# EAGLE design sensing (EAGLE 9.5.1)
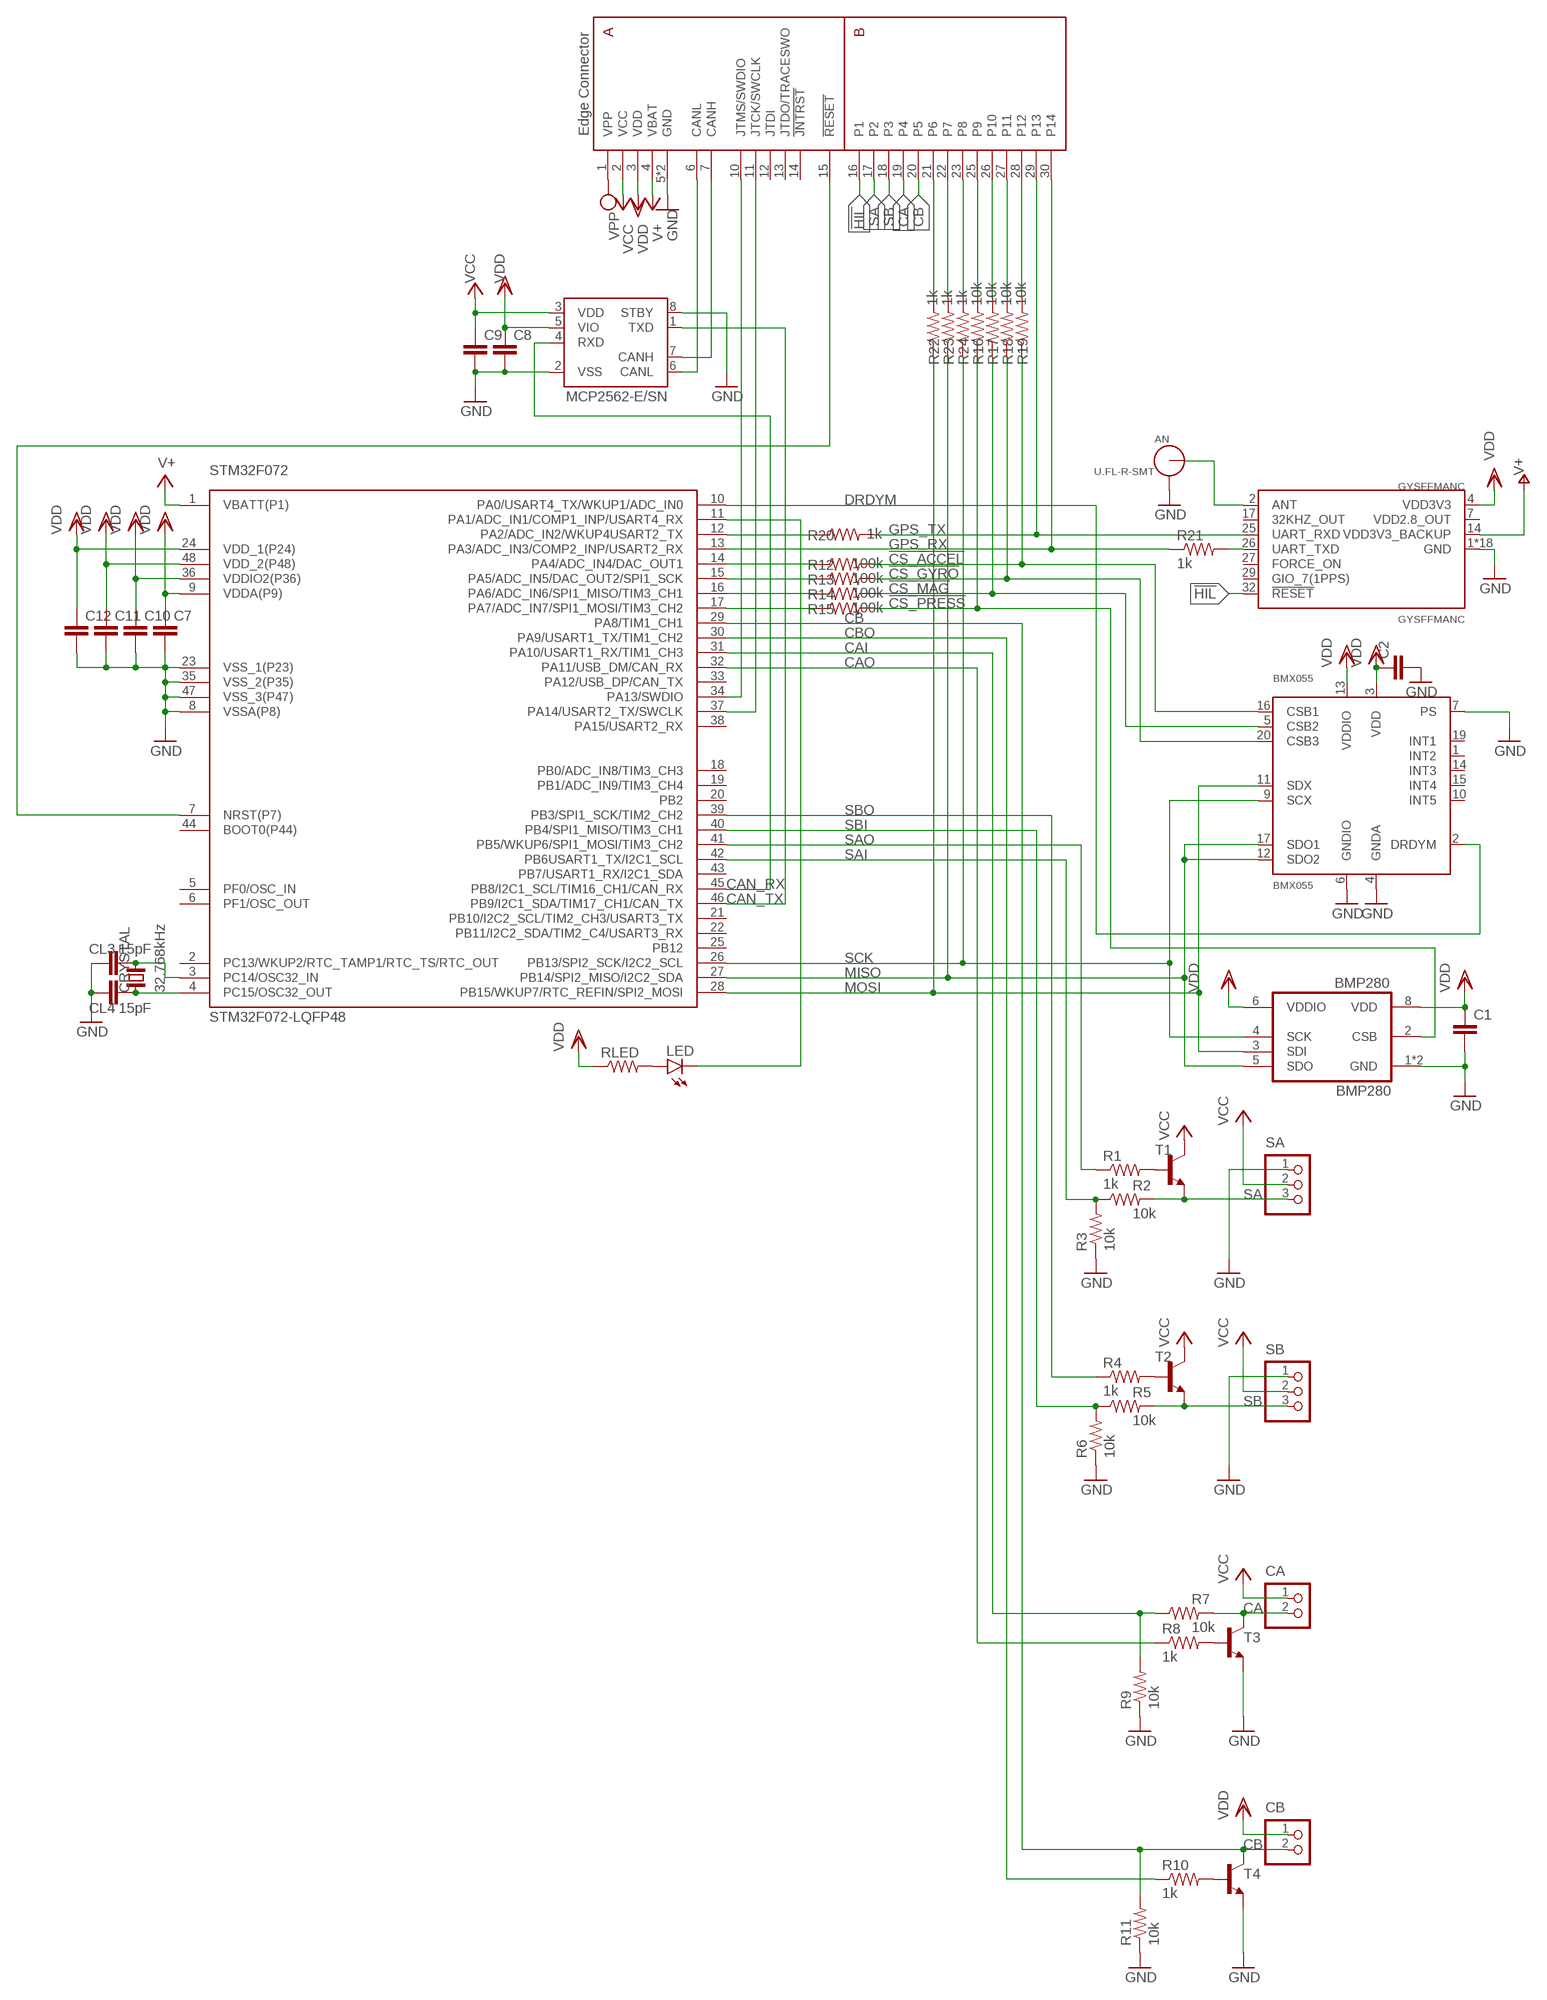
[diagram p0: schematic, sheet 1]

## Parts
AN  U.FL-R-SMT  [U.FL_SMT]
BMP280  BMP280  [BMP280]
BMX055  BMX055  [BMX055]
C1  C-EUC0603K  [C0603K]
C2  C-EUC0603K  [C0603K]
C7  C-EUC0603K  [C0603K]
C8  C-EUC0603K  [C0603K]
C9  C-EUC0603K  [C0603K]
C10  C-EUC0603K  [C0603K]
C11  C-EUC0603K  [C0603K]
C12  C-EUC0603K  [C0603K]
CA  S2B-PH-K-S  [S2B-PH-K-S]
CB  S2B-PH-K-S  [S2B-PH-K-S]
CL3  15pF  C-EUC0603K  [C0603K]
CL4  15pF  C-EUC0603K  [C0603K]
CRYSTAL  32.768kHz  CRYTALFC-255  [FC-255]
GYSFFMANC  GYSFFMANC  [GYSFFMANC]
LED  LEDCHIP-LED0603  [CHIP-LED0603]
MCP2562  MCP2562-E/SN  [SOIC127P600X175-8N]
R1  1k  R-US_R0603  [R0603]
R2  10k  R-US_R0603  [R0603]
R3  10k  R-US_R0603  [R0603]
R4  1k  R-US_R0603  [R0603]
R5  10k  R-US_R0603  [R0603]
R6  10k  R-US_R0603  [R0603]
R7  10k  R-US_R0603  [R0603]
R8  1k  R-US_R0603  [R0603]
R9  10k  R-US_R0603  [R0603]
R10  1k  R-US_R0603  [R0603]
R11  10k  R-US_R0603  [R0603]
R12  100k  R-US_R0603  [R0603]
R13  100k  R-US_R0603  [R0603]
R14  100k  R-US_R0603  [R0603]
R15  100k  R-US_R0603  [R0603]
R16  10k  R-US_R0603  [R0603]
R17  10k  R-US_R0603  [R0603]
R18  10k  R-US_R0603  [R0603]
R19  10k  R-US_R0603  [R0603]
R20  1k  R-US_R0603  [R0603]
R21  1k  R-US_R0603  [R0603]
R22  1k  R-US_R0603  [R0603]
R23  1k  R-US_R0603  [R0603]
R24  1k  R-US_R0603  [R0603]
RLED  R-US_R0603  [R0603]
SA  S3B-PH-K-S  [S3B-PH-K-S]
SB  S3B-PH-K-S  [S3B-PH-K-S]
STM32F072  STM32F072-LQFP48  [LQFP48]
T1  BC817-NPN-SOT23-BEC  [SOT23-BEC]
T2  BC817-NPN-SOT23-BEC  [SOT23-BEC]
T3  BC817-NPN-SOT23-BEC  [SOT23-BEC]
T4  BC817-NPN-SOT23-BEC  [SOT23-BEC]
U$2  EDGE30  [EDGE30]

## Nets
!CS_ACCEL!: BMX055.16(CSB1) R12.2 R19.1
!CS_GYRO!: BMX055.20(CSB3) R13.2 R18.1
!CS_MAG!: BMX055.5(CSB2) R14.2 R17.1
!CS_PRESS!: BMP280.2(CSB) R15.2 R16.1
!HIL!: GYSFFMANC.32(!RESET!) U$2.16(P1)
CA: CA.2 R7.2 T3.C U$2.19(P4)
CAI: R7.1 R9.2 STM32F072.31(PA10/USART1_RX/TIM1_CH3)
CAN_RX: MCP2562.4(RXD) STM32F072.45(PB8/I2C1_SCL/TIM16_CH1/CAN_RX)
CAN_TX: MCP2562.1(TXD) STM32F072.46(PB9/I2C1_SDA/TIM17_CH1/CAN_TX)
CANH1: MCP2562.7(CANH) U$2.7(CANH)
CANL1: MCP2562.6(CANL) U$2.6(CANL)
CAO: R8.1 STM32F072.32(PA11/USB_DM/CAN_RX)
CB: CB.2 R11.2 STM32F072.29(PA8/TIM1_CH1) T4.C U$2.20(P5)
CBO: R10.1 STM32F072.30(PA9/USART1_TX/TIM1_CH2)
DRDYM: BMX055.2(DRDYM) STM32F072.10(PA0/USART4_TX/WKUP1/ADC_IN0)
GND: AN.GND1 AN.GND2 BMP280.1(GND) BMP280.7(GND) BMX055.4(GNDA) BMX055.6(GNDIO) BMX055.7(PS) C1.2 C2.2 C7.2 C8.2 C9.2 C10.2 C11.2 C12.2 CL3.1 CL4.1 GYSFFMANC.1(GND) GYSFFMANC.3(GND) GYSFFMANC.8(GND) GYSFFMANC.10(GND) GYSFFMANC.12(GND) GYSFFMANC.22(GND) GYSFFMANC.33(GND) GYSFFMANC.36(GND) GYSFFMANC.37(GND) GYSFFMANC.38(GND) GYSFFMANC.39(GND) GYSFFMANC.40(GND) GYSFFMANC.41(GND) GYSFFMANC.42(GND) GYSFFMANC.43(GND) GYSFFMANC.44(GND) GYSFFMANC.45(GND) GYSFFMANC.46(GND) MCP2562.2(VSS) MCP2562.8(STBY) R3.1 R6.1 R9.1 R11.1 SA.1 SB.1 STM32F072.8(VSSA(P8)) STM32F072.23(VSS_1(P23)) STM32F072.35(VSS_2(P35)) STM32F072.47(VSS_3(P47)) T3.E T4.E U$2.5(GND) U$2.8(GND)
GPS_RX: R21.1 STM32F072.13(PA3/ADC_IN3/COMP2_INP/USART2_RX) U$2.30(P14)
GPS_TX: GYSFFMANC.25(UART_RXD) R20.2 U$2.29(P13)
MISO: BMP280.5(SDO) BMX055.12(SDO2) BMX055.17(SDO1) R23.1 STM32F072.27(PB14/SPI2_MISO/I2C2_SDA)
MOSI: BMP280.3(SDI) BMX055.11(SDX) R22.1 STM32F072.28(PB15/WKUP7/RTC_REFIN/SPI2_MOSI)
N$1: AN.SIG(ANT) GYSFFMANC.2(ANT)
N$2: R12.1 STM32F072.14(PA4/ADC_IN4/DAC_OUT1)
N$5: R1.2 T1.B
N$6: R4.2 T2.B
N$7: R13.1 STM32F072.15(PA5/ADC_IN5/DAC_OUT2/SPI1_SCK)
N$8: R14.1 STM32F072.16(PA6/ADC_IN6/SPI1_MISO/TIM3_CH1)
N$10: R15.1 STM32F072.17(PA7/ADC_IN7/SPI1_MOSI/TIM3_CH2)
N$11: R20.1 STM32F072.12(PA2/ADC_IN2/WKUP4USART2_TX)
N$12: GYSFFMANC.26(UART_TXD) R21.2
N$13: R8.2 T3.B
N$14: R10.2 T4.B
N$15: R24.2 U$2.23(P8)
N$16: R23.2 U$2.22(P7)
N$17: R22.2 U$2.21(P6)
N$34: R19.2 U$2.28(P12)
N$35: R18.2 U$2.27(P11)
N$36: R17.2 U$2.26(P10)
N$43: R16.2 U$2.25(P9)
N$51: LED.C STM32F072.11(PA1/ADC_IN1/COMP1_INP/USART4_RX)
N$70: CL4.2 CRYSTAL.1 STM32F072.4(PC15/OSC32_OUT)
N$71: CL3.2 CRYSTAL.2 STM32F072.3(PC14/OSC32_IN)
N$74: LED.A RLED.2
NRST1: STM32F072.7(NRST(P7)) U$2.15(!RESET!)
SA: R2.2 SA.3 T1.E U$2.17(P2)
SAI: R2.1 R3.2 STM32F072.42(PB6USART1_TX/I2C1_SCL)
SAO: R1.1 STM32F072.41(PB5/WKUP6/SPI1_MOSI/TIM3_CH2)
SB: R5.2 SB.3 T2.E U$2.18(P3)
SBI: R5.1 R6.2 STM32F072.40(PB4/SPI1_MISO/TIM3_CH1)
SBO: R4.1 STM32F072.39(PB3/SPI1_SCK/TIM2_CH2)
SCK: BMP280.4(SCK) BMX055.9(SCX) R24.1 STM32F072.26(PB13/SPI2_SCK/I2C2_SCL)
SWCLK1: STM32F072.37(PA14/USART2_TX/SWCLK) U$2.11(JTCK/SWCLK)
SWDIO1: STM32F072.34(PA13/SWDIO) U$2.10(JTMS/SWDIO)
VBAT: GYSFFMANC.14(VDD3V3_BACKUP) STM32F072.1(VBATT(P1)) U$2.4(VBAT) ; supply symbol labelled V+
VCC: C9.1 CA.1 MCP2562.3(VDD) SA.2 SB.2 T1.C T2.C U$2.2(VCC)
VDD: BMP280.6(VDDIO) BMP280.8(VDD) BMX055.3(VDD) BMX055.13(VDDIO) C1.1 C2.1 C7.1 C8.1 C10.1 C11.1 C12.1 CB.1 GYSFFMANC.4(VDD3V3) MCP2562.5(VIO) RLED.1 STM32F072.9(VDDA(P9)) STM32F072.24(VDD_1(P24)) STM32F072.36(VDDIO2(P36)) STM32F072.48(VDD_2(P48)) U$2.3(VDD)
VPP: U$2.1(VPP)
Unconnected: BMX055.1(INT2) BMX055.10(INT5) BMX055.14(INT3) BMX055.15(INT4) BMX055.19(INT1) GYSFFMANC.17(32KHZ_OUT) GYSFFMANC.27(FORCE_ON) GYSFFMANC.29(GIO_7(1PPS)) STM32F072.2(PC13/WKUP2/RTC_TAMP1/RTC_TS/RTC_OUT) STM32F072.5(PF0/OSC_IN) STM32F072.6(PF1/OSC_OUT) STM32F072.18(PB0/ADC_IN8/TIM3_CH3) STM32F072.19(PB1/ADC_IN9/TIM3_CH4) STM32F072.20(PB2) STM32F072.21(PB10/I2C2_SCL/TIM2_CH3/USART3_TX) STM32F072.22(PB11/I2C2_SDA/TIM2_C4/USART3_RX) STM32F072.25(PB12) STM32F072.33(PA12/USB_DP/CAN_TX) STM32F072.38(PA15/USART2_RX) STM32F072.43(PB7/USART1_RX/I2C1_SDA) STM32F072.44(BOOT0(P44)) U$2.12(JTDI) U$2.13(JTDO/TRACESWO) U$2.14(!JNTRST!)

## Power pins joined to a net without a drawn wire
VDD2.8_OUT: GYSFFMANC.7(VDD2.8_OUT)

## Library data of the parts
AN = connector:U.FL-R-SMT: U.FL-R-SMT Antenna Connector; DIGIKEY: H122041-ND; MANUFACTURER: Hirose; MPN: U.FL-R-SMT-1(01)
BMP280 = bosch-bmp280:BMP280: The BMP280 is an absolute barometric pressure sensor especially designed for mobile applications. The sensor module is housed in an extremely compact 8-pin metal-lid LGA package with a footprint of only 2.0 × 2.5 mm2 and 0.95 mm package height. Its small dimensions and its low power consumption of 2.7 μA @1Hz allow the implementation in battery driven devices such as mobile phones, GPS modules or watches. The library has been designed by Richard Magdycz <https://www.facebook.com/groups/eaglecadsoftUK>
BMX055 = BMX055:BMX055: BMX055 Small, versatile 9 - axis sensor module; DIGI-KEY_PART_NUMBER: 828-1060-1-ND; DIGI-KEY_PURCHASE_URL: https://www.digikey.jp/product-detail/en/bosch-sensortec/BMX055/828-1060-1-ND/6136311?utm_source=snapeda&utm_medium=aggregator&utm_campaign=symbol; MF: Bosch Sensortec; MP: BMX055; PACKAGE: LGA-20 Bosch
C1 C2 C7-C12 CL3 CL4 = rcl:C-EU: CAPACITOR, European symbol; SPICEPREFIX: C
CA CB = jst-ph:S2B-PH-*: Wire-to-Board 2.0mm pitch side mount connector Source: http://www.jst-mfg.com/product/pdf/jpn/PH.pdf http://www.jst-mfg.com/product/detail.php?series=199
CRYSTAL = crystal':CRYTAL: CRYSTAL
GYSFFMANC = gps:GYSFFMANC
LED = led:LED: LED OSRAM: - CHIPLED LG R971, LG N971, LY N971, LG Q971, LY Q971, LO R971, LY R971 LH N974, LH R974 LS Q976, LO Q976, LY Q976 LO Q996 - Hyper CHIPLED LW Q18S LB Q993, LB Q99A, LB R99A - SideLED LS A670, LO A670, LY A670, LG A670, LP A670 LB A673, LV A673, LT A673, LW A673 LH A674 LY A675 LS A676, LA A676, LO A676, LY A676, LW A676 LS A679, LY A679, LG A679 - Hyper Micro SIDELED® LS Y876, LA Y876, LO Y876, LY Y876 LT Y87S - SmartLED LW L88C, LW L88S LB L89C, LB L89S, LG L890 LS L89K, LO L89K, LY L89K LS L896, LA L896, LO L896, LY L896 - TOPLED LS T670, LO T670, LY T670, LG T670, LP T670 LSG T670, LSP T670, LSY T670, LOP T670, LYG T670 LG T671, LOG T671, LSG T671 LB T673, LV T673, LT T673, LW T673 LH T674 LS T676, LA T676, LO T676, LY T676, LB T676, LH T676, LSB T676, LW T676 LB T67C, LV T67C, LT T67C, LS T67K, LO T67K, LY T67K, LW E67C LS E67B, LA E67B, LO E67B, LY E67B, LB E67C, LV E67C, LT E67C LW T67C LS T679, LY T679, LG T679 LS T770, LO T770, LY T770, LG T770, LP T770 LB T773, LV T773, LT T773, LW T773 LH T774 LS E675, LA E675, LY E675, LS T675 LS T776, LA T776, LO T776, LY T776, LB T776 LHGB T686 LT T68C, LB T68C - Hyper Mini TOPLED® LB M676 - Mini TOPLED Santana® LG M470 LS M47K, LO M47K, LY M47K Source: http://www.osram.convergy.de LUXEON: - LUMILED® LXK2-PW12-R00, LXK2-PW12-S00, LXK2-PW14-U00, LXK2-PW14-V00 LXK2-PM12-R00, LXK2-PM12-S00, LXK2-PM14-U00 LXK2-PE12-Q00, LXK2-PE12-R00, LXK2-PE12-S00, LXK2-PE14-T00, LXK2-PE14-U00 LXK2-PB12-K00, LXK2-PB12-L00, LXK2-PB12-M00, LXK2-PB14-N00, LXK2-PB14-P00, LXK2-PB14-Q00 LXK2-PR12-L00, LXK2-PR12-M00, LXK2-PR14-Q00, LXK2-PR14-R00 LXK2-PD12-Q00, LXK2-PD12-R00, LXK2-PD12-S00 LXK2-PH12-R00, LXK2-PH12-S00 LXK2-PL12-P00, LXK2-PL12-Q00, LXK2-PL12-R00 Source: www.luxeon.com KINGBRIGHT: KA-3528ASYC Source: www.kingbright.com
MCP2562 = mcp2562-E_SN:MCP2562-E/SN: MCP2562 Series 5 V Surface Mount High-Speed CAN Transceiver - SOIC-8; AVAILABILITY: Unavailable; DESCRIPTION: Microchip MCP2562-E/SN, CAN Transceiver 1MBps 1-channel IEC 61000-4-2, 8-Pin SOIC; MF: Microchip; MP: MCP2562-E/SN; PACKAGE: SO-8 Microchip; PRICE: None
R1-R24 = resistor:R-US_: RESISTOR, American symbol
RLED = rcl:R-US_: RESISTOR, American symbol; SPICEPREFIX: R
SA SB = jst-ph:S3B-PH-*: Wire-to-Board 2.0mm pitch side mount connector Source: http://www.jst-mfg.com/product/pdf/jpn/PH.pdf http://www.jst-mfg.com/product/detail.php?series=199
STM32F072 = stm32f0:STM32F072
T1-T4 = transistor-neu-to92:*-NPN-: NPN Transistror
U$2 = bus:EDGE30

## Board
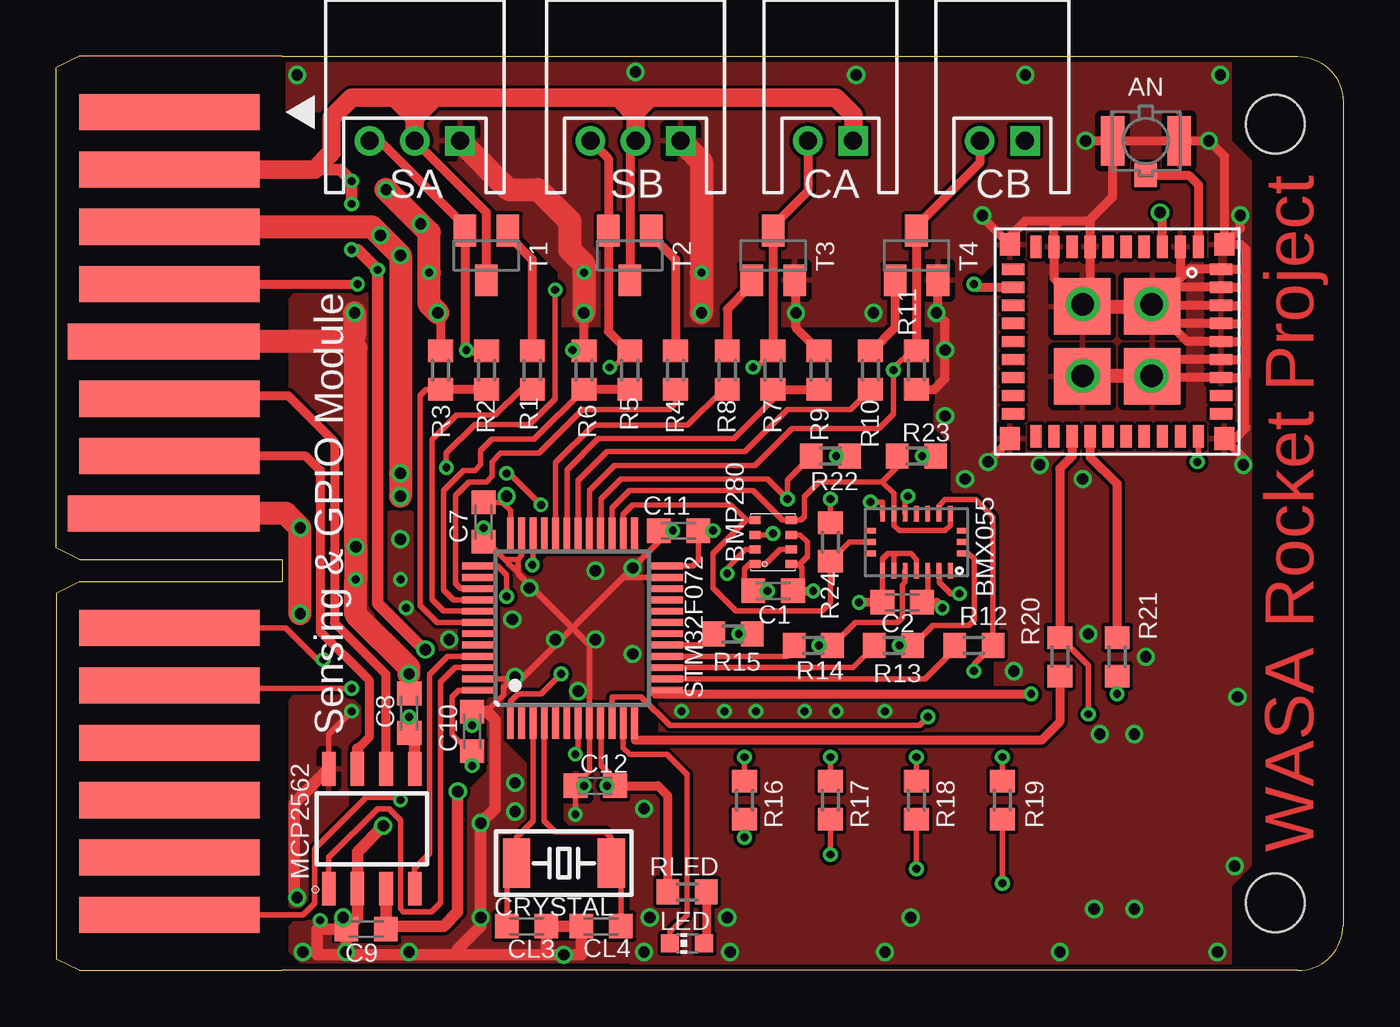
[diagram p1: board, top side]
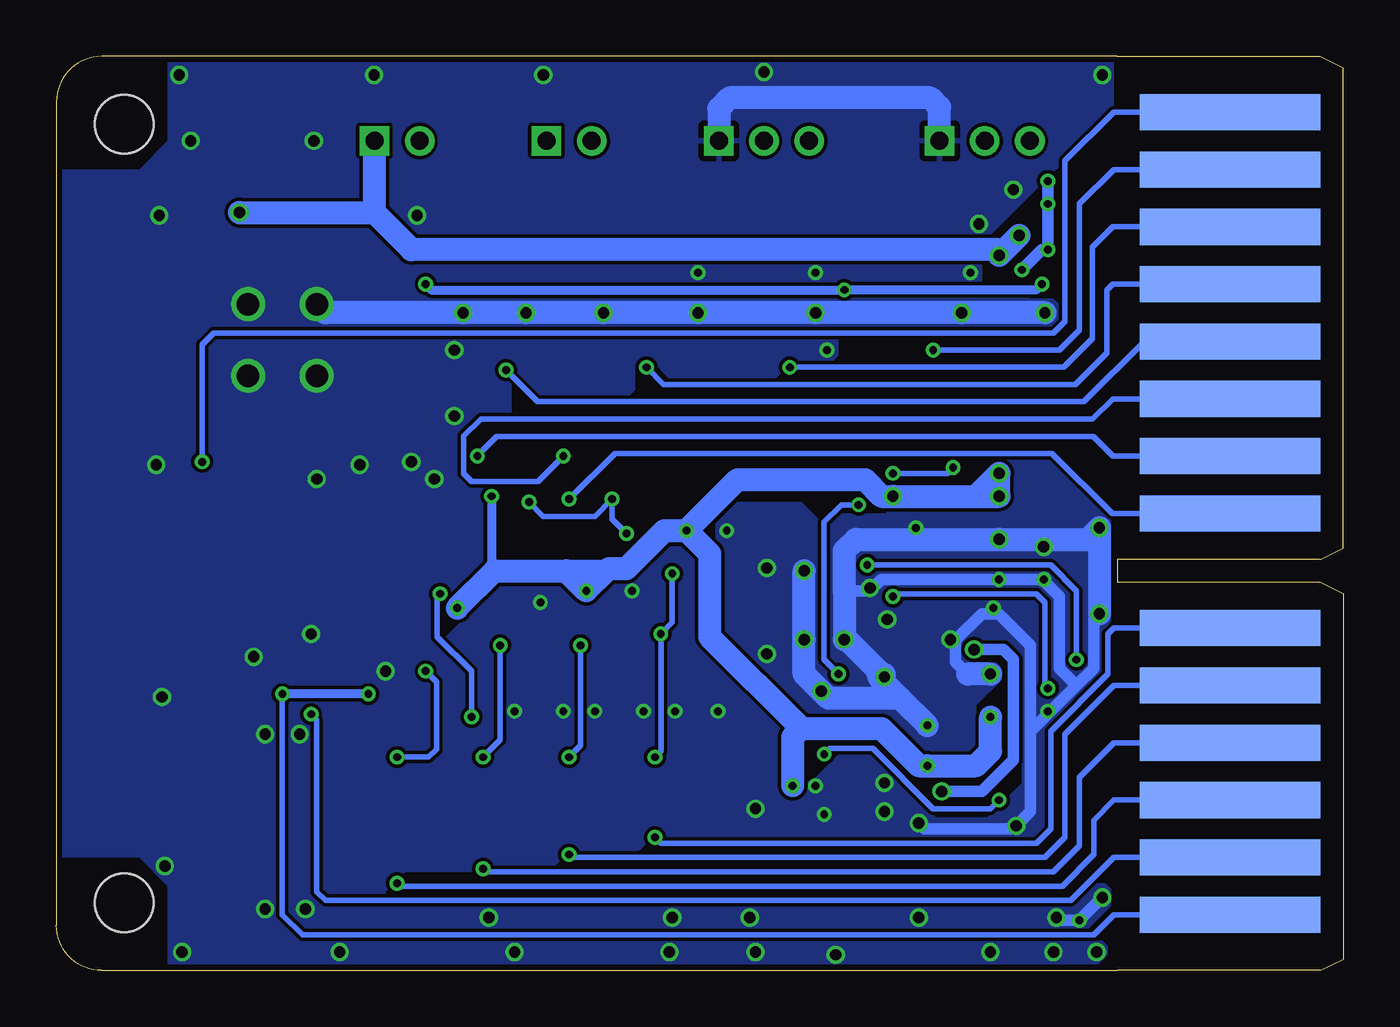
[diagram p2: board, bottom side, seen from below]

Size 57 x 40.5 mm. Coordinates in mm from the lower left corner, seen from the top.
Outline: 10,40.5 55,40.5 arc-90 57,38.5 57,2 arc-90 55,0 10,0
Copper layers (1*16): Top 0.035mm / dielectric 1.5mm / Bottom 0.035mm
Design rules "SeeedStudio_2layer_DRU_no_angle_20140221": minimum track width 6mil, minimum drill 12mil, track to track 6mil, track to pad 6mil, pad to pad 6mil, via to via 6mil, smd to smd 0mil, copper to edge 10mil, drill to drill 10mil, minimum pad ring 10mil, minimum via ring 6mil, stop-mask expansion 2mil, vias tented up to drill 100mil, thermal gap 10mil
Holes 2.6 mm at 54,3 54,37.5

### Footprints (pad centres in the part's own frame; a part is rotated, then mirrored left to right if it is on the bottom)
U.FL_SMT = smd 1.05 x 2.2: GND1 -1.475,0; GND2 1.475,0 | smd 1 x 1.05: SIG 0,-1.525
BMP280 = smd 0.35 x 0.5: 1 0.975,-0.8; 2 0.325,-0.8; 3 -0.325,-0.8; 4 -0.975,-0.8; 5 -0.975,0.8; 6 -0.325,0.8; 7 0.325,0.8; 8 0.975,0.8
BMX055 = smd 0.675 x 0.25: 1 1.262,1.5; 2 1.262,1; 3 1.262,0.5; 4 1.262,0; 5 1.262,-0.5; 6 1.262,-1; 7 1.262,-1.5; 11 -1.262,-1.5; 12 -1.262,-1; 13 -1.262,-0.5; 14 -1.262,0; 15 -1.262,0.5; 16 -1.262,1; 17 -1.262,1.5 | smd 0.25 x 0.55: 8 0.5,-2.05; 9 0,-2.05; 10 -0.5,-2.05; 18 -0.5,2.05; 19 0,2.05; 20 0.5,2.05
C0603K = smd 1.05 x 1.08: 1 -0.875,0; 2 0.875,0
S2B-PH-K-S = drill 0.8 square: 1 1,0 | drill 0.8: 2 -1,0
FC-255 = smd 1.2 x 2.2: 1 -2.1,0; 2 2.1,0
GYSFFMANC = smd 1 x 0.9: 1 -4.3,4.75; 12 -4.3,-4.75; 22 4.3,-4.75; 33 4.3,4.75 | smd 1 x 0.5: 2 -4.2,3.6; 3 -4.2,2.8; 4 -4.2,2; 5 -4.2,1.2; 6 -4.2,0.4; 7 -4.2,-0.4; 8 -4.2,-1.2; 9 -4.2,-2; 10 -4.2,-2.8; 11 -4.2,-3.6; 23 4.2,-3.6; 24 4.2,-2.8; 25 4.2,-2; 26 4.2,-1.2; 27 4.2,-0.4; 28 4.2,0.4; 29 4.2,1.2; 30 4.2,2; 31 4.2,2.8; 32 4.2,3.6 | smd 0.5 x 1: 13 -3.2,-4.6; 14 -2.4,-4.6; 15 -1.6,-4.6; 16 -0.8,-4.6; 17 0,-4.6; 18 0.8,-4.6; 19 1.6,-4.6; 20 2.4,-4.6; 21 3.2,-4.6; 34 3.2,4.6; 35 2.4,4.6; 36 1.6,4.6; 37 0.8,4.6; 38 0,4.6; 39 -0.8,4.6; 40 -1.6,4.6; 41 -2.4,4.6; 42 -3.2,4.6 | smd 2.5 x 2.5: 43 -1.55,1.55; 44 -1.55,-1.55; 45 1.55,-1.55; 46 1.55,1.55
CHIP-LED0603 = smd 0.8 x 0.8: A 0,-0.75; C 0,0.75
SOIC127P600X175-8N = smd 1.5 x 0.6: 1 -2.65,1.905; 2 -2.65,0.635; 3 -2.65,-0.635; 4 -2.65,-1.905; 5 2.65,-1.905; 6 2.65,-0.635; 7 2.65,0.635; 8 2.65,1.905
R0603 = smd 1 x 1.1: 1 -0.85,0; 2 0.85,0
S3B-PH-K-S = drill 0.8 square: 1 2,0 | drill 0.8: 2 0,0; 3 -2,0
LQFP48 = smd 1.5 x 0.3: 1 -4.15,2.75; 2 -4.15,2.25; 3 -4.15,1.75; 4 -4.15,1.25; 5 -4.15,0.75; 6 -4.15,0.25; 7 -4.15,-0.25; 8 -4.15,-0.75; 9 -4.15,-1.25; 10 -4.15,-1.75; 11 -4.15,-2.25; 12 -4.15,-2.75; 25 4.15,-2.75; 26 4.15,-2.25; 27 4.15,-1.75; 28 4.15,-1.25; 29 4.15,-0.75; 30 4.15,-0.25; 31 4.15,0.25; 32 4.15,0.75; 33 4.15,1.25; 34 4.15,1.75; 35 4.15,2.25; 36 4.15,2.75 | smd 0.3 x 1.5: 13 -2.75,-4.15; 14 -2.25,-4.15; 15 -1.75,-4.15; 16 -1.25,-4.15; 17 -0.75,-4.15; 18 -0.25,-4.15; 19 0.25,-4.15; 20 0.75,-4.15; 21 1.25,-4.15; 22 1.75,-4.15; 23 2.25,-4.15; 24 2.75,-4.15; 37 2.75,4.15; 38 2.25,4.15; 39 1.75,4.15; 40 1.25,4.15; 41 0.75,4.15; 42 0.25,4.15; 43 -0.25,4.15; 44 -0.75,4.15; 45 -1.25,4.15; 46 -1.75,4.15; 47 -2.25,4.15; 48 -2.75,4.15
SOT23-BEC = smd 1 x 1.4: B -0.95,-1.1; C 0,1.1; E 0.95,-1.1
EDGE30 = smd 1.6 x 8: 1 -17.78,-5; 2 -15.24,-5; 3 -12.7,-5; 4 -10.16,-5; 6 -5.08,-5; 7 -2.54,-5; 10 5.08,-5; 11 7.62,-5; 12 10.16,-5; 13 12.7,-5; 14 15.24,-5; 15 17.78,-5 | smd 1.6 x 8.5: 5 -7.62,-5.25; 8 0,-5.25 | smd 1.6 x 8 bottom: 16 -17.78,-5; 17 -15.24,-5; 18 -12.7,-5; 19 -10.16,-5; 20 -7.62,-5; 21 -5.08,-5; 22 -2.54,-5; 23 0,-5; 25 5.08,-5; 26 7.62,-5; 27 10.16,-5; 28 12.7,-5; 29 15.24,-5; 30 17.78,-5

### Placement (x,y rotation side)
AN  48.26,36.76 0 top
BMP280  31.75,18.98 270 top
BMX055  38.1,18.98 270 top
C1  31.75,16.82 180 top
C2  37.47,16.31 180 top
C7  18.92,19.87 270 top
C8  15.63,11.41 90 top
C9  13.72,1.84 180 top
C10  18.41,10.6 90 top
C11  27.56,19.49 180 top
C12  23.88,8.19 180 top
CA  34.29,36.76 0 top
CB  41.91,36.76 0 top
CL3  20.83,1.96 180 top
CL4  24.13,1.96 0 top
CRYSTAL  22.48,4.76 180 top
GYSFFMANC  46.99,27.87 270 top
LED  27.94,1.2 90 top
MCP2562  13.97,6.28 90 top
R1  21.08,26.6 90 top
R2  19.05,26.6 90 top
R3  17.02,26.6 270 top
R4  27.43,26.6 90 top
R5  25.4,26.6 90 top
R6  23.37,26.6 270 top
R7  31.75,26.6 90 top
R8  29.72,26.6 90 top
R9  33.78,26.6 270 top
R10  36.07,26.6 90 top
R11  38.1,26.6 90 top
R12  40.64,14.41 0 top
R13  37.08,14.41 0 top
R14  33.53,14.41 0 top
R15  29.97,14.92 0 top
R16  30.48,7.55 270 top
R17  34.29,7.55 270 top
R18  38.1,7.55 270 top
R19  41.91,7.55 270 top
R20  44.45,13.9 90 top
R21  46.99,13.9 90 top
R22  34.29,22.79 0 top
R23  38.1,22.79 0 top
R24  34.29,18.98 90 top
RLED  27.94,3.49 0 top
SA  15.88,36.76 0 top
SB  25.65,36.76 0 top
STM32F072  22.86,15.17 90 top
T1  19.05,31.68 180 top
T2  25.4,31.68 180 top
T3  31.75,31.68 0 top
T4  38.1,31.68 0 top
U$2  10,20.25 270 top

### Tracks (layer width: path | path; a pad name or v marks a point on that pad's centre or on a via)
!CS_ACCEL!  (via drill 0.35)
  Top 0.254: BMX055.16 39.1,20.59 39.37,20.86 40.73,20.86 41.49,20.1 R12.2 40.64,13.56 v40.64,13.27 | R19.1 v41.91,9.46
  Bottom 0.254: v40.64,13.27 40.16,12.79 40.16,9.81 40.51,9.46 v41.91,9.46
!CS_GYRO!  (via drill 0.35)
  Top 0.254: BMX055.20 40.4,18.48 40.66,18.23 40.66,15.53 40.42,15.3 38.82,15.3 R13.2 v37.34,14.41 | R18.1 v38.1,9.46
  Bottom 0.254: v37.34,14.41 37.34,10.22 v38.1,9.46
!CS_MAG!  (via drill 0.35)
  Top 0.254: BMX055.5 37.6,17.21 37.47,17.08 37.47,15.65 37.25,15.42 35.39,15.42 R14.2 v33.78,14.41 | R17.1 v34.29,9.46
  Bottom 0.254: v33.78,14.41 33.78,9.96 v34.29,9.46
!CS_PRESS!  (via drill 0.35)
  Top 0.254: BMP280.2 30.54,18.66 29.72,17.84 v29.72,17.58 | R15.2 v30.23,14.92 | R16.1 v30.48,9.46
  Bottom 0.254: v29.72,17.58 29.72,15.42 v30.23,14.92 30.23,9.71 v30.48,9.46
!HIL!  (via drill 0.35)
  Top 0.254: GYSFFMANC.32 50.59,22.58 v50.55,22.54
  Bottom 0.254: U$2.16 10.16,38.03 12.32,35.87 12.32,28.76 12.83,28.25 50.04,28.25 50.55,27.74 v50.55,22.54
CA  (via drill 0.35)
  Top 0.254: R7.2 31.03,26.73 v30.86,26.73
  Top 0.406: R7.2 T3.C 31.75,32.98 33.29,34.52 CA.2
  Bottom 0.254: U$2.19 10.21,30.41 10.46,30.16 10.46,27.36 11.86,25.96 30.1,25.96 v30.86,26.73
CAI
  Top 0.254: R7.1 31.75,25.29 30.02,23.56 24,23.56 22.61,22.17 STM32F072.31
  Top 0.406: R7.1 R9.2
CAN_RX
  Top 0.254: STM32F072.45 17.33,13.92 16.54,13.13 16.54,5.18 15.88,4.52 MCP2562.4
CAN_TX
  Top 0.254: STM32F072.46 17.66,13.42 17.02,12.78 17.02,3 16.61,2.6 15.37,2.6 15.24,2.72 15.24,6.66 14.73,7.17 14.22,7.17 12.06,5.01 MCP2562.1
CANH1
  Top 0.406: 13.34,9.82 13.84,10.33 13.84,12.87 11.68,15.03 11.68,22.16 11.05,22.79 U$2.7
  Top 0.508: MCP2562.7 13.34,9.82
CANL1
  Top 0.406: MCP2562.6 14.61,13.12 12.32,15.41 12.32,23.43 10.29,25.46 5.13,25.46 U$2.6
CAO
  Top 0.254: R8.1 29.54,25.75 27.97,24.18 23.79,24.18 22.11,22.5 STM32F072.32
CB  (via drill 0.35)
  Top 0.254: R11.2 37.85,27.45 37.08,26.69 v37.08,26.6 37.08,24.66 36.45,24.02 32.59,24.02 30.95,22.38 24.73,22.38 23.61,21.26 STM32F072.29
  Top 0.406: R11.2 T4.C 38.1,32.98 40.91,35.79 CB.2
  Bottom 0.254: U$2.20 8.81,27.87 11.48,25.2 35.56,25.2 35.69,25.2 v37.08,26.6
CBO
  Top 0.254: R10.1 35.18,24.86 32.38,24.86 30.51,22.99 24.38,22.99 23.11,21.71 STM32F072.30
DRDYM  (via drill 0.35)
  Top 0.254: STM32F072.10 24.61,12.09 24.64,12.12 25.91,12.12 27.18,10.85 38.23,10.85 v38.61,11.23 | BMX055.2 39.12,17.7 39.12,17.2 39.62,16.69 v40.01,16.69
  Bottom 0.254: v40.01,16.69 40.13,16.57 40.13,14.79 38.61,13.27 v38.61,11.23
GND  (via drill 0.35, 0.5, 1)
  Top 0.254: STM32F072.35 20.61,18.38 20.45,18.22 | 20.45,17.63 20.45,18.22 | STM32F072.47 20.19,12.92 | 20.19,12.92 20.61,12.92 22.86,15.17 | 22.86,15.17 20.45,17.58 20.45,17.63 | 22.86,15.17 23.61,14.42 STM32F072.8 23.61,8.82 23,8.21 C12.2 23,6.93 v22.99,6.91 | STM32F072.23 25.11,17.42 | 22.86,15.17 25.11,17.42 | 19.16,11.47 19.06,11.47 19.81,12.22 19.81,12.54 20.19,12.92 | C7.2 19.18,18.74 19.34,18.74 19.86,18.22 | 20.45,18.22 19.86,18.22 | 19.86,18.22 20.45,17.63 | 25.11,17.42 v25.53,17.84 26.68,18.99 C11.2 | MCP2562.8 12.06,10.47 v13.08,11.49 | BMX055.4 38.1,18.22 37.85,18.47 37.21,18.47 | 37.21,18.47 36.83,18.47 36.6,18.24 BMX055.7 36.6,16.32 C2.2 | BMX055.6 37.1,18.36 37.21,18.47 | BMP280.7 32.06,18.66 31.41,18 BMP280.1 30.7,18 30.48,17.79 30.48,17.2 30.86,16.82 C1.2
  Top 0.406: 33.73,27.45 R9.1 32.77,28.47 v32.77,29.14 32.77,30.51 T3.E | C1.2 v31.5,16.82 | C2.2 v35.56,16.31 | GYSFFMANC.3 49.79,30.67 | 49.79,30.67 49.53,30.41 | 49.53,30.41 48.9,29.77 | 48.9,29.77 GYSFFMANC.43 | 49.79,36.7 AN.GND2 | AN.GND1 AN.GND2 | AN.GND1 46.78,34.27 45.79,33.27 | 45.79,33.27 GYSFFMANC.8 45.79,29.77 GYSFFMANC.44 44.19,30.67 GYSFFMANC.10 44.19,32.94 44.45,33.2 | 45.79,33.27 45.72,33.2 44.45,33.2 | 44.45,33.2 42.93,33.2 42.24,32.52 GYSFFMANC.12 41.02,33.39 v41.02,33.46 | GYSFFMANC.1 51.82,32.25 | 49.79,30.67 50.19,31.07 GYSFFMANC.42 52.55,31.07 52.7,30.92 | 49.53,30.41 49.67,30.27 GYSFFMANC.41 52.69,30.27 52.7,30.28 | 48.9,29.77 49.2,29.47 GYSFFMANC.40 52.63,29.47 52.7,29.39 | GYSFFMANC.43 49.29,28.67 GYSFFMANC.39 52.67,28.67 52.7,28.63 | GYSFFMANC.43 50.09,27.87 GYSFFMANC.38 52.58,27.87 52.7,27.74 | 52.63,26.27 GYSFFMANC.36 48.59,26.27 GYSFFMANC.46 49.29,27.07 GYSFFMANC.37 52.67,27.07 52.7,27.11 | 52.63,26.27 52.7,26.35 52.7,27.11 | 52.7,27.11 52.7,27.74 | 52.7,27.74 52.7,28.63 | 52.7,28.63 52.7,29.39 | 52.7,29.39 52.7,30.28 | 52.7,30.28 52.7,30.92 | 52.7,30.92 52.7,31.93 52.47,32.17 GYSFFMANC.1 | 52.63,26.27 52.63,24.14 52.7,24.06 52.22,23.57 GYSFFMANC.33 52.58,22.73 v52.58,22.41 | v23.37,29.14 R6.1 22.9,27.45 v22.86,27.49 | T4.E 39.05,29.2 v38.99,29.14 39.37,28.76 v39.37,27.49 39.37,26.22 38.9,25.75 R11.1 | R3.1 17.02,29.01 v16.89,29.14 | GYSFFMANC.22 42.24,23.5 v41.27,22.54 | GYSFFMANC.1 52.45,32.88 v52.45,33.46 | AN.GND2 v51.05,36.76 51.74,36.07 GYSFFMANC.1 | v45.59,36.76 AN.GND1
  Top 0.508: C9.2 13.34,2.33 MCP2562.2 13.34,5.26 v14.48,6.41 | 12.84,0.95 13.1,0.69 17.78,0.69 | C9.2 12.84,0.95 | v18.41,10.85 C10.2 19.06,11.47 19.43,11.11 19.43,7.17 v18.8,6.53 v18.8,2.34 18.8,1.96 17.78,0.95 17.78,0.69 | v15.62,13.14 v15.63,13.13 C8.2 | v18.92,19.61 C7.2 | v27.3,19.49 C11.2 | v22.48,0.69 23.25,0.69 CL4.1 CL3.1 21.7,0.69 v22.48,0.69 | 23.25,0.71 23.24,0.69 | v22.48,0.69 17.78,0.69 | C9.2 11.56,1.84 11.56,0.69 12.59,0.69 12.84,0.95 | MCP2562.8 10.54,7.41 10.54,3.36 v10.67,3.23
  Top 0.61: 48.54,26.37 v48.51,26.35 | GYSFFMANC.46 v48.51,26.35 | v48.51,26.35 v45.47,26.35 | v45.47,29.52 45.44,29.49 GYSFFMANC.44 GYSFFMANC.43
  Top 1.016: U$2.8 10.16,20.25 v10.79,19.61 v10.79,15.8 | 12.95,27.87 U$2.5 | v15.62,13.14 15.62,13.42 13.26,15.78 v13.26,17.32 v13.26,18.77 13.26,27.56 12.95,27.87 | v13.21,29.14 13.21,28.12 12.95,27.87 | SB.1 28.57,35.84 v28.57,30.92 v28.57,29.14 | SA.1 20.03,34.6 21.34,34.6 22.73,33.2 22.73,31.93 23.37,31.3 v23.37,30.92 v23.37,29.14 | v16.89,29.14 16.51,29.52 v16.51,30.92 16.51,32.7 v16.13,33.08 v14.61,34.6
  Bottom 0.508: 16.64,13.14 17.17,13.67 17.17,14.64 16,15.8 15.24,15.8 13.84,14.41 13.84,10.6 | 13.84,10.6 13.84,7.04 v14.48,6.41 14.61,6.28 18.54,6.28 v18.8,6.53 | 13.84,10.6 11.81,12.63 | 11.81,12.63 11.05,13.39 11.05,15.55 v10.79,15.8 | 11.05,19.36 v10.79,19.61 | 22.1,16.82 20.95,16.82 20.46,17.32 v13.26,17.32 13.26,17.25 12.57,16.57 12.57,13.39 11.81,12.63 | v12.7,2.34 12.57,2.22 v11.68,2.22 v10.67,3.23
  Bottom 1.016: v15.62,13.14 16.64,13.14 | 19.62,12.06 20.57,13.01 20.57,13.14 20.32,13.14 v20.32,13.01 21.97,14.66 v22.1,14.66 22.1,16.82 22.1,18.6 21.59,19.11 v15.24,19.11 11.3,19.11 v10.79,19.61 v10.79,15.8 | 19.62,12.06 v18.41,10.85 | 19.62,12.06 22.8,12.06 v23.11,12.38 23.88,13.14 v23.88,14.66 v23.88,17.71 | SA.1 17.88,38.25 18.29,38.66 27.18,38.66 27.65,38.19 SB.1 | v13.21,29.14 v16.89,29.14 v23.37,29.14 v28.57,29.14 v32.77,29.14 v36.2,29.14 v38.99,29.14 45.09,29.14 v45.47,29.52
  other vias: 23.37,8.19 20.32,8.31 20.32,7.04 10.92,0.82 12.83,0.82 20.95,16.95 20.19,15.55 25.53,14.03 15.62,0.82 48.51,29.52 27.69,11.49 29.59,11.49 30.99,11.49 33.15,11.49 34.54,11.49 36.7,11.49 26.04,0.82 26.29,2.34 29.72,2.34 29.84,0.82 36.7,0.82 37.85,2.34 26.04,7.17 44.45,0.82 45.97,2.72 47.75,2.72 51.44,0.82 52.2,4.63 47.75,10.47 46.23,10.47 39.37,24.57 40.26,21.77 42.42,13.27 48.26,13.9 45.72,14.92 45.47,21.77 43.56,22.41 52.32,12.12 10.67,39.68 25.65,39.81 35.43,39.68 42.93,39.68 51.56,39.68 15.49,16.06 15.24,17.33 17.4,14.66
  pour Top: 19.68,17.96 19.68,13.14 26.04,13.14 26.04,17.96
  pour Top: 19.68,13.14 19.68,12.12 20.32,12.12 20.32,12.38 21.97,12.38 21.97,13.14
  pour Top: 22.86,13.14 22.73,13.14 22.73,12.5 22.73,11.99 26.04,11.99 26.04,13.14
  pour Bottom: 23.24,17.33 23.24,20 24,20.76 27.81,20.76 27.81,12.25 26.67,11.11 20.32,11.11 18.92,9.71 16.51,9.71 16.26,9.96 16.26,20.25 22.23,20.25 22.73,19.74 22.73,13.9
  pour Bottom: 16.26,13.77 16.13,13.65 15.88,13.65 15.49,13.65 15.37,13.65 15.11,13.39 15.11,13.01 15.11,12.88 16.26,11.74
  pour Bottom: 21.4,21.46 20.07,22.79 13.08,22.79 10.29,20 10.29,13.27 12.95,10.6 14.48,10.6 14.61,10.72 14.61,14.03 15.11,14.54 16.26,14.54 16.26,16.31
  pour Bottom: 13.21,5.9 23.11,5.9 23.75,6.53 23.75,8.19 22.35,9.58 20.83,9.58 18.03,6.79 15.75,6.79 14.22,8.31 14.22,11.23 13.21,11.23
  pour Top (no thermals): 25.53,1.33 25.53,0.31 14.86,0.31 14.86,2.09 19.43,2.09 19.43,1.33
  pour Top (no thermals): 19.94,12.12 19.81,11.99 19.81,10.22 20.95,9.07 20.95,6.79 19.68,5.52 19.68,2.98 19.3,2.6 19.3,2.09 17.91,2.09 17.91,2.22 18.03,2.34 18.03,7.8 19.05,8.82 19.05,11.99 19.18,12.12
  pour Top (no thermals): 14.99,0.31 10.79,0.31 10.29,0.82 10.29,1.96 10.54,2.22 11.94,2.22 12.19,1.96 12.19,1.2 14.99,1.2
  pour Top (no thermals): 21.21,17.58 21.21,17.84 21.72,18.34 26.04,18.34 26.04,17.71 21.34,17.71
  pour Top (no thermals): 13.84,15.8 13.84,25.2 13.46,24.82 13.46,16.19
  pour Bottom: 13.46,0.31 13.46,2.22 25.53,2.22 25.53,0.31
  pour Bottom: 13.84,0.18 10.92,0.18 10.41,0.69 10.41,1.07 10.67,1.33 13.84,1.33
  pour Bottom: 11.68,1.84 13.08,1.84 13.34,2.09 13.34,2.22 13.34,2.6 13.08,2.85 12.7,2.85 11.94,2.85 10.92,3.87 10.54,3.87 10.29,3.61 10.29,2.85 11.18,1.96 11.3,1.84
  pour Top: 10.41,2.72 10.79,2.72 11.18,3.11 11.18,5.52 12.95,7.3 12.95,9.96 13.59,10.6 13.59,11.61 12.95,12.25 10.54,12.25 10.29,11.99 10.29,2.85
  pour Top: 12.83,15.8 12.83,22.66 10.29,25.2 10.29,29.77 10.54,30.03 13.84,30.03 14.1,29.77 14.1,15.17 13.46,15.17
  pour Bottom: 10.16,40.57 10.16,38.03 15.24,32.95 16.51,31.68 34.29,31.68 40.64,31.68 43.18,34.22 43.18,40.57
  pour Bottom: 43.18,40.57 52.07,40.57 52.07,36.76 53.34,35.49 57.15,35.49 57.15,5.01 53.34,5.01 52.07,3.74 52.07,-0.07 42.42,-0.07 42.42,32.19 43.18,32.95
  pour Bottom: 40.64,30.41 40.64,12.63 38.1,12.63 38.1,22.79 36.83,24.06 36.83,26.6 35.56,25.33 31.75,25.33 31.37,25.71 31.37,26.85 31.11,27.11 30.73,27.11 29.72,26.09 25.27,26.09 24.51,26.85 22.73,26.85 22.35,27.23 22.35,30.41
  pour Bottom: 22.35,29.9 22.35,28.25 13.08,28.25 12.57,28.76 12.57,29.52 12.83,29.77 13.84,29.77 14.48,30.41 22.35,30.41
  pour Bottom: 16,30.28 16,31.68 41.91,31.68 41.91,30.41 16.13,30.41
  pour Bottom: 25.4,-0.07 43.18,-0.07 43.18,11.36 36.83,17.71 31.75,17.71 30.48,18.98 29.21,18.98 27.94,17.71 27.94,15.17 24.13,11.36 24.13,8.82 22.86,7.55 22.86,6.15 23.37,5.64 30.86,5.64 31.5,5.01 34.54,5.01 35.18,4.38 41.53,4.38 42.8,3.11 25.4,3.11
  pour Bottom: 40.64,32.95 43.18,32.95 43.18,11.36 40.64,11.36
  pour Bottom: 39.37,32.95 43.18,32.95 43.18,27.87 39.37,27.87
  pour Bottom: 43.18,3.74 43.18,-0.07 12.7,-0.07 12.7,2.72 12.83,2.85 42.29,2.85
  pour Top: 10.16,40.57 10.16,38.03 11.43,38.03 15.11,38.03 22.23,30.92 22.23,28.51 40.77,28.51 40.77,30.54 42.42,32.19 43.31,33.08 52.07,33.08 52.07,40.57
  pour Top: 52.07,36.76 52.96,35.87 52.96,4.63 52.07,3.74 52.07,-0.07 41.53,-0.07 41.53,31.3 46.99,36.76
  pour Top: 41.91,18.98 39.62,21.27 39.62,23.3 38.86,24.06 38.86,30.03 41.53,30.03 41.91,29.65
  pour Top: 41.91,12.63 26.67,12.63 26.67,10.09 41.91,10.09
  pour Top: 41.91,-0.07 25.4,-0.07 25.4,6.28 22.86,6.28 22.48,6.66 22.48,8.82 24.13,8.82 25.4,10.09 41.91,10.09
  pour Top: 17.78,15.17 17.78,14.15 16.89,14.15 14.61,16.44 14.61,20.25 14.73,20.38 15.75,20.38 15.88,20.25 15.88,16.19 16.89,15.17
GPS_RX  (via drill 0.35)
  Top 0.254: 26.67,12.25 26.84,12.42 STM32F072.13
  Top 0.406: 26.54,12.25 26.67,12.25 v43.18,12.25 | R21.1 v46.99,12.25
  Bottom 0.254: U$2.30 10.16,2.47 11.05,1.58 46.1,1.58 46.99,2.47 v46.99,12.25
  Bottom 0.406: v43.18,12.25 v46.99,12.25
GPS_TX  (via drill 0.35)
  Top 0.254: v45.72,11.36 45.72,13.52 44.45,14.79
  Top 0.406: GYSFFMANC.25 44.99,22.78 44.45,22.24 44.45,14.79 R20.2
  Bottom 0.254: U$2.29 10.16,5.01 12.06,3.11 45.09,3.11 45.47,3.49 45.47,11.11 v45.72,11.36
MISO
  Top 0.254: STM32F072.27 24.61,20.5 25.38,21.27 30.86,21.27 32.17,19.95 BMP280.5 32.98,19.95 33.15,20.12 33.15,21.01 33.78,21.65 36.58,21.65 | 36.58,21.65 37.1,21.12 BMX055.12 37.1,19.73 37.34,19.49 39.37,19.49 39.6,19.72 BMX055.17 | 36.58,21.65 37.25,22.32 R23.1
MOSI  (via drill 0.35)
  Top 0.254: STM32F072.28 24.13,19.34 24.13,20.89 25.02,21.77 31.5,21.77 v32.38,20.89 32.38,21.73 R22.1 | BMP280.3 31.69,19.3 v31.75,19.36 | BMX055.11 36.6,20.73 36.58,20.76 v36.07,20.76
  Bottom 0.254: v31.75,19.36 32.38,20 v32.38,20.89 33.15,20.12 35.43,20.12 v36.07,20.76
N$1
  Top 0.406: AN.SIG 50.17,35.23 50.59,34.81 GYSFFMANC.2
N$2
  Top 0.254: R12.1 39.79,14.23 38.48,12.92 STM32F072.14
N$5
  Top 0.406: T1.B 20,32.58 21.08,31.5 R1.2
N$6
  Top 0.406: T2.B 26.35,32.58 27.43,31.5 R4.2
N$7
  Top 0.254: R13.1 36.23,14.36 35.3,13.42 STM32F072.15
N$8
  Top 0.254: R14.1 32.68,14.23 32.37,13.92 STM32F072.16
N$10
  Top 0.254: STM32F072.17 28.63,14.42 R15.1
N$11
  Top 0.254: STM32F072.12 25.65,10.98 25.65,10.22
  Top 0.406: 25.65,10.22 43.65,10.22 44.45,11.02 R20.1
N$12
  Top 0.406: GYSFFMANC.26 45.79,22.76 46.99,21.56 R21.2
N$13
  Top 0.406: T3.B 30.8,30.38 29.72,29.3 R8.2
N$14
  Top 0.406: T4.B 37.15,28.48 36.12,27.45 R10.2
N$15  (via drill 0.35)
  Top 0.254: R24.2 v34.29,20.89
  Bottom 0.254: v34.29,20.89 32.26,22.91 12.9,22.91 10.23,20.25 U$2.23
N$16  (via drill 0.35)
  Top 0.254: R23.2 v38.35,22.79
  Bottom 0.254: v38.35,22.79 37.49,23.65 11.07,23.65 10.21,22.79 U$2.22
N$17  (via drill 0.35)
  Top 0.254: R22.2 v34.54,22.79
  Bottom 0.254: 4.87,25.46 U$2.21 10.21,25.33 11.1,24.44 38.2,24.44 38.96,23.68 38.96,22.03 38.6,21.68 35.66,21.68 v34.54,22.79
N$34  (via drill 0.35)
  Top 0.254: R19.2 v41.91,3.87
  Bottom 0.254: U$2.28 10.16,7.55 11.05,6.66 11.05,5.14 12.45,3.74 41.78,3.74 v41.91,3.87
N$35  (via drill 0.35)
  Top 0.254: R18.2 v38.1,4.5
  Bottom 0.254: U$2.27 10.16,10.09 11.68,8.57 11.68,5.52 12.83,4.38 37.97,4.38 v38.1,4.5
N$36  (via drill 0.35)
  Top 0.254: R17.2 v34.29,5.14
  Bottom 0.254: U$2.26 10.16,12.63 12.32,10.47 12.32,5.9 13.21,5.01 34.16,5.01 v34.29,5.14
N$43  (via drill 0.35)
  Top 0.254: R16.2 v30.48,5.9
  Bottom 0.254: U$2.25 10.16,15.17 10.41,14.92 10.41,13.14 12.95,10.6 12.95,6.28 13.59,5.64 30.23,5.64 v30.48,5.9
N$51
  Top 0.254: LED.C 27.19,1.71 27.93,2.45 27.93,8.7 27.05,9.58 25.4,9.58 25.11,9.87 STM32F072.11
N$70
  Top 0.254: STM32F072.4 21.61,6.64 22.1,6.15 24.32,6.15 24.58,5.9 CRYSTAL.1 25,4.33 CL4.2
N$71
  Top 0.254: STM32F072.3 21.11,6.63 20.38,5.9 CRYSTAL.2 19.95,4.33 CL3.2
N$74
  Top 0.406: RLED.2 28.79,1.3 LED.A
NRST1  (via drill 0.35)
  Top 0.254: v22.99,9.58 23.11,9.71 STM32F072.7 | U$2.15 10.92,2.47 11.43,2.98 11.43,5.39 13.72,7.68 15.11,7.68 v15.24,7.55
  Bottom 0.254: v22.99,9.58 22.73,9.84 20.83,9.84 18.16,7.17 15.62,7.17 v15.24,7.55
SA  (via drill 0.35)
  Top 0.406: SA.3 14.32,36.76 18.1,32.98 T1.E 18.1,27.55 v18.16,27.49 18.2,27.45 R2.2
  Bottom 0.254: U$2.17 10.16,35.49 11.68,33.97 11.68,28.38 12.57,27.49 v18.16,27.49
SAI
  Top 0.254: R2.1 19,25.75 | R3.2 16.38,25.75 16.11,25.47 16.11,16.18 16.87,15.42 STM32F072.42
  Top 0.406: R2.1 R3.2
SAO
  Top 0.254: STM32F072.41 17.15,15.92 16.64,16.43 16.64,23.52 17.73,24.61 19.43,24.61 20.57,25.75 R1.1
SB  (via drill 0.35)
  Top 0.254: v24.51,26.73 24.68,26.73 R5.2
  Top 0.406: SB.3 24.45,35.96 T2.E 24.45,28.31 25.31,27.45 R5.2
  Bottom 0.254: U$2.18 10.21,32.95 11.1,32.06 11.1,28 12.37,26.73 v24.51,26.73
SBI
  Top 0.254: R6.2 21.17,23.55 19.3,23.55 18.8,23.04 18.8,22.41 18.54,22.16 18.03,22.16 17.15,21.27 17.15,16.86 17.59,16.42 STM32F072.40
  Top 0.406: R5.1 R6.2
SBO
  Top 0.254: R4.1 27.43,25.12 27.18,24.86 23.32,24.86 21.37,22.92 19.68,22.92 19.3,22.54 19.3,21.9 19.05,21.65 18.28,21.65 17.68,21.04 17.68,17.15 17.91,16.92 STM32F072.39
SCK
  Top 0.254: STM32F072.26 25.11,20.21 25.53,20.63 29.89,20.63 30.57,19.95 | 30.57,19.95 29.08,18.47 29.08,16.95 30.1,15.93 33.91,15.93 34.29,16.31 R24.1 35.14,18.98 BMX055.9 | 30.57,19.95 BMP280.4
SWCLK1  (via drill 0.35)
  Top 0.254: v13.08,12.5 5.13,12.5 U$2.11 | v19.94,16.57 19.94,17.52 19.54,17.92 STM32F072.37
  Bottom 0.254: v19.94,16.57 19.81,16.69 13.59,16.69 13.21,16.31 13.21,12.63 v13.08,12.5
SWDIO1  (via drill 0.35)
  Top 0.254: v11.81,13.77 11.56,13.77 10.16,15.17 U$2.10 | STM32F072.34 21.11,17.99 v21.08,17.96
  Bottom 0.254: v11.81,13.77 11.81,16.82 12.95,17.96 v21.08,17.96
VBAT  (via drill 0.35)
  Top 0.254: STM32F072.1 20.11,11.91 20.45,12.25 21.46,12.25 v22.35,13.14 | v21.46,20.63 20.07,22.03 v19.94,22.03 | v17.27,22.28 17.27,22.92 18.54,24.19 20.96,24.19 21.91,25.13 21.91,25.14 22.1,25.33 v22.1,30.16
  Top 0.406: U$2.4 v13.34,30.41 | GYSFFMANC.14 40.74,30.27 40.64,30.37 v40.64,30.41
  Bottom 0.254: v22.35,13.14 22.99,13.77 22.99,19.87 22.23,20.63 v21.46,20.63 | v19.94,22.03 17.53,22.03 v17.27,22.28
  Bottom 0.406: v13.34,30.41 13.59,30.16 v22.1,30.16 40.39,30.16 v40.64,30.41
VCC  (via drill 0.35, 0.5)
  Top 0.406: T1.C 19.05,33.59 SA.2 | T2.C 25.4,36.51 SB.2 25.65,37.01
  Top 0.508: MCP2562.3 14.61,1.85 C9.1 14.72,1.96 17.14,1.96 17.78,2.6 v17.78,7.93 | v16.35,14.22 16.26,14.22 14.22,16.26 v14.22,31.05 13.34,31.93 v13.08,31.93 | v13.08,33.97 v13.08,34.98 12.57,35.49 11.43,35.49
  Top 0.813: SB.2 25.65,37.9 | 25.65,37.9 24.89,38.66 | 16.76,38.66 15.88,37.78 | SA.2 15.88,37.78 | 16.76,38.66 24.89,38.66 | U$2.2 11.43,35.49 12.19,36.25 12.19,37.78 13.08,38.66 14.99,38.66 | 14.99,38.66 16.76,38.66 | 15.88,37.78 14.99,38.66 | 24.89,38.66 26.29,38.66 | 26.29,38.66 34.54,38.66 35.31,37.9 35.31,36.78 CA.1 | 25.65,37.9 25.65,38.03 26.29,38.66
  Bottom 0.508: v17.78,7.93 16,7.93 14.61,9.33 14.61,13.77 15.05,14.22 v16.35,14.22 | v14.22,31.05 13.34,31.93 v13.08,31.93 v13.08,33.97 v13.08,34.98
VDD  (via drill 0.35, 0.5)
  Top 0.254: STM32F072.36 20.11,20.38 19.74,20.74 | STM32F072.9 24.13,11 24.13,9.09 24.75,8.47 C12.1 | STM32F072.48 17.82,12.42 17.53,12.12 17.53,10.47 18.27,9.72 C10.1 | C7.1 19.74,20.74 | STM32F072.24 28.19,17.92 28.43,18.16 C11.1 | BMP280.6 32.95,19.3 33.27,18.98 33.27,18.34 32.93,18 | 32.93,18 BMP280.8 | BMX055.3 38.6,16.57 C2.1 | 32.93,18 32.93,17.92 33.02,17.84 33.02,17.22 C1.1 | BMX055.13 37.6,20.89 v37.72,21.01 | v19.94,21.01 19.94,20.94 19.74,20.74
  Top 0.406: RLED.1 27.09,7.74 26.64,8.19 C12.1 | C1.1 v33.53,16.82 | C2.1 38.99,16.31 v39.24,16.06 | GYSFFMANC.4 48.99,33.49 v48.9,33.59
  Top 0.508: v18.41,9.07 C10.1 | C12.1 v24.38,8.19 | v15.62,11.23 v15.63,11.23 C8.1 15.88,10.28 MCP2562.5 | v29.08,19.49 C11.1
  Top 1.016: U$2.3 13.97,32.95 v14.35,32.57 v15.24,31.68 v15.24,22.03 v15.24,21.01
  Bottom 0.406: v37.72,21.01 37.72,17.84 37.59,17.71
  Bottom 1.016: v24.38,8.19 24.38,10.34 24,10.72 | 24,10.72 20.45,10.72 18.8,9.07 v18.41,9.07 16.26,9.07 15.62,9.71 v15.62,11.23 | v29.08,19.49 28.07,18.47 28.07,14.79 24,10.72 | 16.26,21.01 v15.24,21.01 v15.24,22.03 16.26,21.01 | 16.26,21.01 v19.94,21.01 20.45,21.01 21.18,21.75 26.83,21.75 v29.08,19.49 | v39.24,16.06 37.59,17.71 34.42,17.71 | 34.42,17.71 v33.53,16.82 32.64,17.71 | v29.08,19.49 30.07,19.49 31.75,17.81 32.54,17.81 32.64,17.71 | 42.91,33.57 CB.1 | 42.91,33.57 41.27,31.93 15.24,31.93 v15.24,31.68 v14.35,32.57 | 34.42,17.71 32.64,17.71 | v48.9,33.59 48.88,33.57 42.91,33.57

### Text on the board
Top: WASA Rocket Project
tNames: Sensing & GPIO Module
tStop: WASA Rocket Project
bStop: Designed by @fujiy0, 2019